# EAGLE design R210I (EAGLE 6.6.0)
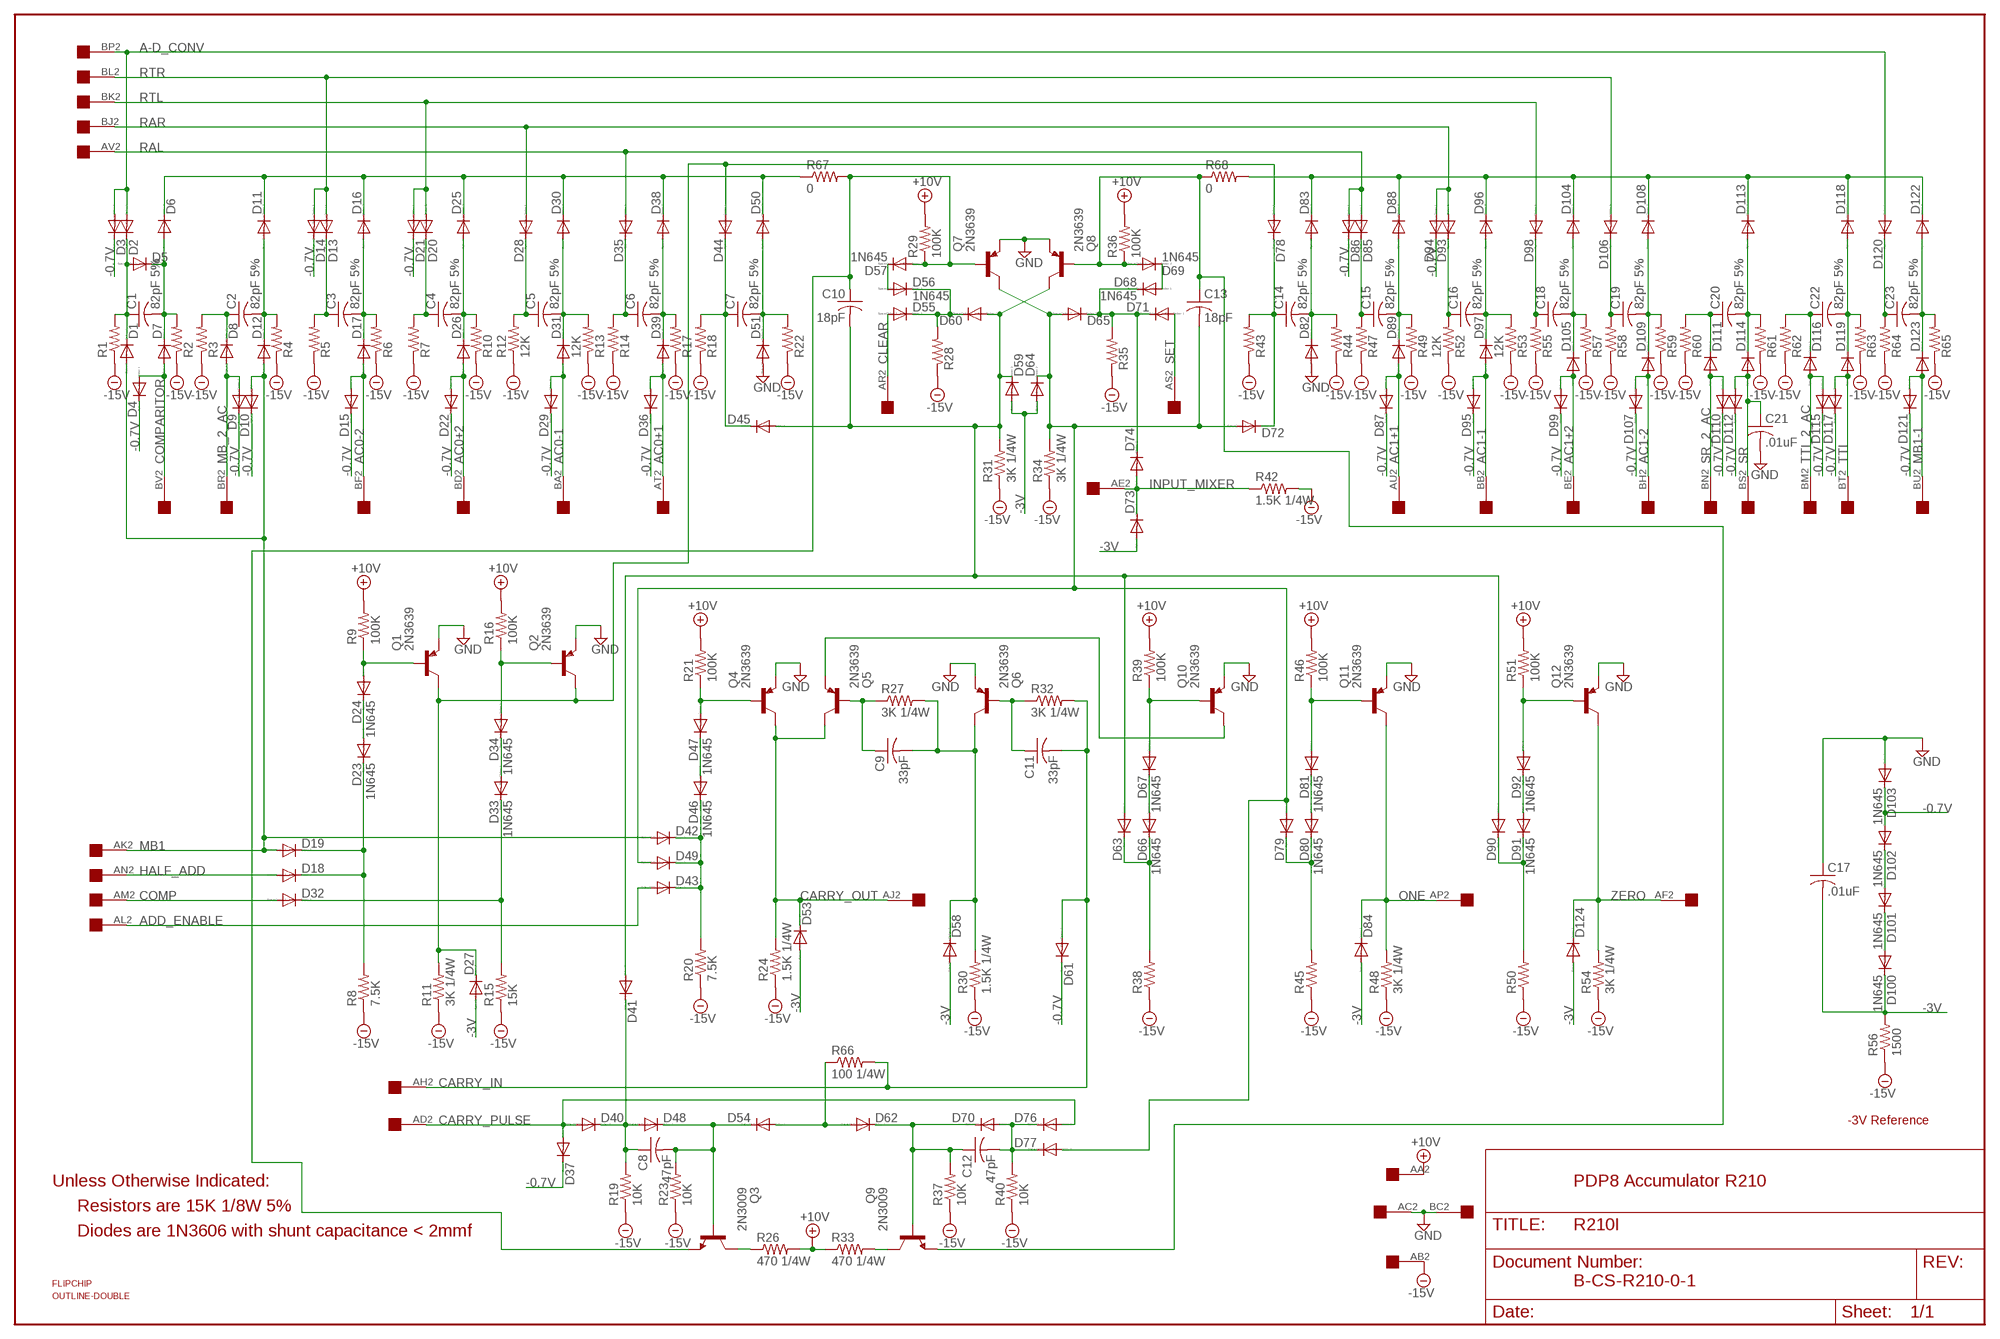
[diagram p0: schematic, sheet 1]

## Parts
C1  82pF 5%  C-US075-032X103  [C075-032X103]
C2  82pF 5%  C-US075-032X103  [C075-032X103]
C3  82pF 5%  C-US075-032X103  [C075-032X103]
C4  82pF 5%  C-US075-032X103  [C075-032X103]
C5  82pF 5%  C-US075-032X103  [C075-032X103]
C6  82pF 5%  C-US075-032X103  [C075-032X103]
C7  82pF 5%  C-US075-032X103  [C075-032X103]
C8  47pF  C-US075-032X103  [C075-032X103]
C9  33pF  C-US075-032X103  [C075-032X103]
C10  18pF  C-US075-032X103  [C075-032X103]
C11  33pF  C-US075-032X103  [C075-032X103]
C12  47pF  C-US075-032X103  [C075-032X103]
C13  18pF  C-US075-032X103  [C075-032X103]
C14  82pF 5%  C-US075-032X103  [C075-032X103]
C15  82pF 5%  C-US075-032X103  [C075-032X103]
C16  82pF 5%  C-US075-032X103  [C075-032X103]
C17  .01uF  C-US050-025X075  [C050-025X075]
C18  82pF 5%  C-US075-032X103  [C075-032X103]
C19  82pF 5%  C-US075-032X103  [C075-032X103]
C20  82pF 5%  C-US075-032X103  [C075-032X103]
C21  .01uF  C-US050-025X075  [C050-025X075]
C22  82pF 5%  C-US075-032X103  [C075-032X103]
C23  82pF 5%  C-US075-032X103  [C075-032X103]
D1  1N4148DO35-10  [DO35-10]
D2  1N4148DO35-10  [DO35-10]
D3  1N4148DO35-10  [DO35-10]
D4  1N4148DO35-10  [DO35-10]
D5  1N4148DO35-10  [DO35-10]
D6  1N4148DO35-10  [DO35-10]
D7  1N4148DO35-10  [DO35-10]
D8  1N4148DO35-10  [DO35-10]
D9  1N4148DO35-10  [DO35-10]
D10  1N4148DO35-10  [DO35-10]
D11  1N4148DO35-10  [DO35-10]
D12  1N4148DO35-10  [DO35-10]
D13  1N4148DO35-10  [DO35-10]
D14  1N4148DO35-10  [DO35-10]
D15  1N4148DO35-10  [DO35-10]
D16  1N4148DO35-10  [DO35-10]
D17  1N4148DO35-10  [DO35-10]
D18  1N4148DO35-10  [DO35-10]
D19  1N4148DO35-10  [DO35-10]
D20  1N4148DO35-10  [DO35-10]
D21  1N4148DO35-10  [DO35-10]
D22  1N4148DO35-10  [DO35-10]
D23  1N645  1N4148DO35-10  [DO35-10]
D24  1N645  1N4148DO35-10  [DO35-10]
D25  1N4148DO35-10  [DO35-10]
D26  1N4148DO35-10  [DO35-10]
D27  1N4148DO35-10  [DO35-10]
D28  1N4148DO35-10  [DO35-10]
D29  1N4148DO35-10  [DO35-10]
D30  1N4148DO35-10  [DO35-10]
D31  1N4148DO35-10  [DO35-10]
D32  1N4148DO35-10  [DO35-10]
D33  1N645  1N4148DO35-10  [DO35-10]
D34  1N645  1N4148DO35-10  [DO35-10]
D35  1N4148DO35-10  [DO35-10]
D36  1N4148DO35-10  [DO35-10]
D37  1N4148DO35-10  [DO35-10]
D38  1N4148DO35-10  [DO35-10]
D39  1N4148DO35-10  [DO35-10]
D40  1N4148DO35-10  [DO35-10]
D41  1N4148DO35-10  [DO35-10]
D42  1N4148DO35-10  [DO35-10]
D43  1N4148DO35-10  [DO35-10]
D44  1N4148DO35-10  [DO35-10]
D45  1N4148DO35-10  [DO35-10]
D46  1N645  1N4148DO35-10  [DO35-10]
D47  1N645  1N4148DO35-10  [DO35-10]
D48  1N4148DO35-10  [DO35-10]
D49  1N4148DO35-10  [DO35-10]
D50  1N4148DO35-10  [DO35-10]
D51  1N4148DO35-10  [DO35-10]
D53  1N4148DO35-10  [DO35-10]
D54  1N4148DO35-10  [DO35-10]
D55  1N4148DO35-10  [DO35-10]
D56  1N645  1N4148DO35-10  [DO35-10]
D57  1N645  1N4148DO35-10  [DO35-10]
D58  1N4148DO35-10  [DO35-10]
D59  1N4148DO35-10  [DO35-10]
D60  1N4148DO35-10  [DO35-10]
D61  1N4148DO35-10  [DO35-10]
D62  1N4148DO35-10  [DO35-10]
D63  1N4148DO35-10  [DO35-10]
D64  1N4148DO35-10  [DO35-10]
D65  1N4148DO35-10  [DO35-10]
D66  1N645  1N4148DO35-10  [DO35-10]
D67  1N645  1N4148DO35-10  [DO35-10]
D68  1N645  1N4148DO35-10  [DO35-10]
D69  1N645  1N4148DO35-10  [DO35-10]
D70  1N4148DO35-10  [DO35-10]
D71  1N4148DO35-10  [DO35-10]
D72  1N4148DO35-10  [DO35-10]
D73  1N4148DO35-10  [DO35-10]
D74  1N4148DO35-10  [DO35-10]
D76  1N4148DO35-10  [DO35-10]
D77  1N4148DO35-10  [DO35-10]
D78  1N4148DO35-10  [DO35-10]
D79  1N4148DO35-10  [DO35-10]
D80  1N645  1N4148DO35-10  [DO35-10]
D81  1N645  1N4148DO35-10  [DO35-10]
D82  1N4148DO35-10  [DO35-10]
D83  1N4148DO35-10  [DO35-10]
D84  1N4148DO35-10  [DO35-10]
D85  1N4148DO35-10  [DO35-10]
D86  1N4148DO35-10  [DO35-10]
D87  1N4148DO35-10  [DO35-10]
D88  1N4148DO35-10  [DO35-10]
D89  1N4148DO35-10  [DO35-10]
D90  1N4148DO35-10  [DO35-10]
D91  1N645  1N4148DO35-10  [DO35-10]
D92  1N645  1N4148DO35-10  [DO35-10]
D93  1N4148DO35-10  [DO35-10]
D94  1N4148DO35-10  [DO35-10]
D95  1N4148DO35-10  [DO35-10]
D96  1N4148DO35-10  [DO35-10]
D97  1N4148DO35-10  [DO35-10]
D98  1N4148DO35-10  [DO35-10]
D99  1N4148DO35-10  [DO35-10]
D100  1N645  1N4148DO35-10  [DO35-10]
D101  1N645  1N4148DO35-10  [DO35-10]
D102  1N645  1N4148DO35-10  [DO35-10]
D103  1N645  1N4148DO35-10  [DO35-10]
D104  1N4148DO35-10  [DO35-10]
D105  1N4148DO35-10  [DO35-10]
D106  1N4148DO35-10  [DO35-10]
D107  1N4148DO35-10  [DO35-10]
D108  1N4148DO35-10  [DO35-10]
D109  1N4148DO35-10  [DO35-10]
D110  1N4148DO35-10  [DO35-10]
D111  1N4148DO35-10  [DO35-10]
D112  1N4148DO35-10  [DO35-10]
D113  1N4148DO35-10  [DO35-10]
D114  1N4148DO35-10  [DO35-10]
D115  1N4148DO35-10  [DO35-10]
D116  1N4148DO35-10  [DO35-10]
D117  1N4148DO35-10  [DO35-10]
D118  1N4148DO35-10  [DO35-10]
D119  1N4148DO35-10  [DO35-10]
D120  1N4148DO35-10  [DO35-10]
D121  1N4148DO35-10  [DO35-10]
D122  1N4148DO35-10  [DO35-10]
D123  1N4148DO35-10  [DO35-10]
D124  1N4148DO35-10  [DO35-10]
Q1  2N3639  2N3637  [TO39]
Q2  2N3639  2N3637  [TO39]
Q3  2N3009  2N2102  [TO5]
Q4  2N3639  2N3637  [TO39]
Q5  2N3639  2N3637  [TO39]
Q6  2N3639  2N3637  [TO39]
Q7  2N3639  2N3637  [TO39]
Q8  2N3639  2N3637  [TO39]
Q9  2N3009  2N2102  [TO5]
Q10  2N3639  2N3637  [TO39]
Q11  2N3639  2N3637  [TO39]
Q12  2N3639  2N3637  [TO39]
R1  R-US_0207/10  [0207/10]
R2  R-US_0207/10  [0207/10]
R3  R-US_0207/10  [0207/10]
R4  R-US_0207/10  [0207/10]
R5  R-US_0207/10  [0207/10]
R6  R-US_0207/10  [0207/10]
R7  R-US_0207/10  [0207/10]
R8  7.5K  R-US_0207/10  [0207/10]
R9  100K  R-US_0207/10  [0207/10]
R10  R-US_0207/10  [0207/10]
R11  3K 1/4W  R-US_0207/10  [0207/10]
R12  12K  R-US_0207/10  [0207/10]
R13  12K  R-US_0207/10  [0207/10]
R14  R-US_0207/10  [0207/10]
R15  15K  R-US_0207/10  [0207/10]
R16  100K  R-US_0207/10  [0207/10]
R17  R-US_0207/10  [0207/10]
R18  R-US_0207/10  [0207/10]
R19  10K  R-US_0207/10  [0207/10]
R20  7.5K  R-US_0207/10  [0207/10]
R21  100K  R-US_0207/10  [0207/10]
R22  R-US_0207/10  [0207/10]
R23  10K  R-US_0207/10  [0207/10]
R24  1.5K 1/4W  R-US_0207/10  [0207/10]
R26  470 1/4W  R-US_0207/10  [0207/10]
R27  3K 1/4W  R-US_0207/10  [0207/10]
R28  R-US_0207/10  [0207/10]
R29  100K  R-US_0207/10  [0207/10]
R30  1.5K 1/4W  R-US_0207/10  [0207/10]
R31  3K 1/4W  R-US_0207/10  [0207/10]
R32  3K 1/4W  R-US_0207/10  [0207/10]
R33  470 1/4W  R-US_0207/10  [0207/10]
R34  3K 1/4W  R-US_0207/10  [0207/10]
R35  R-US_0207/10  [0207/10]
R36  100K  R-US_0207/10  [0207/10]
R37  10K  R-US_0207/10  [0207/10]
R38  R-US_0207/10  [0207/10]
R39  100K  R-US_0207/10  [0207/10]
R40  10K  R-US_0207/10  [0207/10]
R42  1.5K 1/4W  R-US_0207/10  [0207/10]
R43  R-US_0207/10  [0207/10]
R44  R-US_0207/10  [0207/10]
R45  R-US_0207/10  [0207/10]
R46  100K  R-US_0207/10  [0207/10]
R47  R-US_0207/10  [0207/10]
R48  3K 1/4W  R-US_0207/10  [0207/10]
R49  R-US_0207/10  [0207/10]
R50  R-US_0207/10  [0207/10]
R51  100K  R-US_0207/10  [0207/10]
R52  12K  R-US_0207/10  [0207/10]
R53  12K  R-US_0207/10  [0207/10]
R54  3K 1/4W  R-US_0207/10  [0207/10]
R55  R-US_0207/10  [0207/10]
R56  1500  R-US_0207/10  [0207/10]
R57  R-US_0207/10  [0207/10]
R58  R-US_0207/10  [0207/10]
R59  R-US_0207/10  [0207/10]
R60  R-US_0207/10  [0207/10]
R61  R-US_0207/10  [0207/10]
R62  R-US_0207/10  [0207/10]
R63  R-US_0207/10  [0207/10]
R64  R-US_0207/10  [0207/10]
R65  R-US_0207/10  [0207/10]
R66  100 1/4W  R-US_0207/10  [0207/10]
R67  0  R-US_0207/10  [0207/10]
R68  0  R-US_0207/10  [0207/10]
U$1  DOUBLE  [EDGE-CON4]
U$2  FLIPCHIP  [FLIPCHIP]
U$3  OUTLINE-DOUBLE  [DOUBLE]

## Nets
+10V [Power]: R9.2 R16.2 R21.2 R26.2 R29.2 R33.1 R36.2 R39.2 R46.2 R51.2 U$1.AA2
-0.7V [Power]: D3.C D4.C D9.C D10.C D14.C D15.C D21.C D22.C D29.C D36.C D37.C D61.C D86.C D87.C D94.C D95.C D99.C D102.A D103.C D107.C D110.C D112.C D115.C D117.C D121.C
-3V [Power]: C17.2 D27.A D53.A D58.A D59.A D64.A D73.A D84.A D100.C D124.A R56.2
-15V [Power]: R1.1 R2.1 R3.1 R4.1 R5.1 R6.1 R7.1 R8.1 R10.1 R11.1 R12.1 R13.1 R14.1 R15.1 R17.1 R18.1 R19.1 R20.1 R22.1 R23.1 R24.1 R28.1 R30.1 R31.1 R34.1 R35.1 R37.1 R38.1 R40.1 R42.2 R43.1 R44.1 R45.1 R47.1 R48.1 R49.1 R50.1 R52.1 R53.1 R54.1 R55.1 R56.1 R57.1 R58.1 R59.1 R60.1 R61.1 R62.1 R63.1 R64.1 R65.1 U$1.AB2
A-D_CONV: D2.A D3.A D120.A U$1.BP2
AC0+1: D36.A D39.A U$1.AT2
AC0+2: D22.A D26.A U$1.BD2
AC0-1: D29.A D31.A U$1.BA2
AC0-2: D15.A D17.A U$1.BF2
AC1+1: D87.A D89.A U$1.AU2
AC1+2: D99.A D105.A U$1.BE2
AC1-1: D95.A D97.A U$1.BB2
AC1-2: D107.A D109.A U$1.BH2
ADD_ENABLE: D43.A U$1.AL2
CARRY_IN: C11.2 D61.A R32.2 R66.2 U$1.AH2
CARRY_OUT: D53.C Q4.3(C) Q5.3(C) R24.2 U$1.AJ2
CARRY_PULSE: D37.A D40.A D76.A U$1.AD2
CLEAR: D55.A U$1.AR2
COMP: D32.A U$1.AM2
COMPARITOR: D4.A D7.A U$1.BV2
GND [Power]: C17.1 C21.2 D51.A D82.A D103.A Q1.1(E) Q2.1(E) Q4.1(E) Q6.1(E) Q7.1(E) Q8.1(E) Q10.1(E) Q11.1(E) Q12.1(E) U$1.AC2 U$1.BC2
HALF_ADD: D18.A U$1.AN2
INPUT_MIXER: D73.C D74.A R42.1 U$1.AE2
MB1: D1.A D10.A D12.A D19.A D42.A U$1.AK2
MB1-1: D121.A D123.A U$1.BU2
MB_2_AC: D8.A D9.A U$1.BR2
N$1: D6.C D11.C D16.C D25.C D30.C D38.C D50.C R67.1
N$2: D27.C D44.A D78.A Q1.3(C) Q2.3(C) R11.2
N$3: C1.2 D5.C D6.A D7.C R2.2
N$4: C1.1 D1.C D2.C D5.A R1.2
N$5: D18.C D19.C D23.C R8.2
N$6: C2.1 D8.C R3.2
N$7: C2.2 D11.A D12.C R4.2
N$8: C10.2 D41.A D45.A D59.C D60.A D63.A D90.A Q8.3(C) R31.2
N$9: C13.2 D49.A D64.C D65.A D72.A D77.A D79.A Q7.3(C) R34.2
N$10: D55.C D56.C D60.C R28.2
N$11: D56.A D57.C
N$12: C3.1 D13.C R5.2
N$13: D101.A D102.C
N$14: C3.2 D16.A D17.C R6.2
N$15: C10.1 D57.A Q3.1(E) Q7.2(B) R29.1 R67.2
N$16: D100.A D101.C
N$17: D66.A D67.C
N$18: C4.1 D20.C R7.2
N$19: C4.2 D25.A D26.C R10.2
N$20: C13.1 D69.A Q8.2(B) Q9.1(E) R36.1 R68.1
N$21: D68.A D69.C
N$22: C5.1 D28.C R12.2
N$23: C5.2 D30.A D31.C R13.2
N$24: D65.C D68.C D71.C D74.C R35.2
N$25: D83.C D88.C D96.C D104.C D108.C D113.C D118.C D122.C R68.2
N$26: C6.1 D35.C R14.2
N$27: C6.2 D38.A D39.C R17.2
N$28: C12.1 D62.C D70.C Q9.2(B) R37.2
N$29: C14.1 D72.C D78.C R43.2
N$30: C7.1 D44.C D45.C R18.2
N$31: C7.2 D50.A D51.C R22.2
N$32: C14.2 D82.C D83.A R44.2
N$33: C15.1 D85.C R47.2
N$34: C15.2 D88.A D89.C R49.2
N$35: C16.1 D93.C R52.2
N$36: C16.2 D96.A D97.C R53.2
N$37: C18.1 D98.C R55.2
N$38: C18.2 D104.A D105.C R57.2
N$39: D24.A Q1.2(B) R9.1
N$40: D23.A D24.C
N$41: C19.1 D106.C R58.2
N$42: C19.2 D108.A D109.C R59.2
N$44: D33.A D34.C
N$45: C20.1 D111.C R60.2
N$46: C20.2 D113.A D114.C R61.2
N$47: C12.2 D70.A D76.C D77.C R40.2
N$48: D32.C D33.C R15.2
N$49: C22.1 D116.C R62.2
N$50: C22.2 D118.A D119.C R63.2
N$51: D34.A Q2.2(B) R16.1
N$52: D47.A Q4.2(B) R21.1
N$53: C23.1 D120.C R64.2
N$54: C23.2 D122.A D123.C R65.2
N$55: D46.A D47.C
N$56: D42.C D43.C D46.C D49.C R20.2
N$57: C9.1 Q5.2(B) R27.1
N$58: C9.2 D58.C Q6.3(C) R27.2 R30.2
N$59: Q5.1(E) Q10.3(C)
N$60: C11.1 Q6.2(B) R32.1
N$61: D54.A D62.A R66.1
N$62: D67.A Q10.2(B) R39.1
N$63: D63.C D66.C R38.2
N$64: D81.A Q11.2(B) R46.1
N$65: C8.1 D40.C D41.C D48.A R19.2
N$66: D80.A D81.C
N$67: D79.C D80.C R45.2
N$68: D92.A Q12.2(B) R51.1
N$69: D90.C D91.C R50.2
N$70: D91.A D92.C
N$71: C8.2 D48.C D54.C Q3.2(B) R23.2
N$73: Q3.3(C) R26.1
N$74: Q9.3(C) R33.2
ONE: D84.C Q11.3(C) R48.2 U$1.AP2
RAL: D35.A D85.A D86.A U$1.AV2
RAR: D28.A D93.A D94.A U$1.BJ2
RTL: D20.A D21.A D98.A U$1.BK2
RTR: D13.A D14.A D106.A U$1.BL2
SET: D71.A U$1.AS2
SR: C21.1 D112.A D114.A U$1.BS2
SR_2_AC: D110.A D111.A U$1.BN2
TTI: D117.A D119.A U$1.BT2
TTI_2_AC: D115.A D116.A U$1.BM2
ZERO: D124.C Q12.3(C) R54.2 U$1.AF2
Unconnected: U$1.AA1 U$1.AB1 U$1.AC1 U$1.AD1 U$1.AE1 U$1.AF1 U$1.AH1 U$1.AJ1 U$1.AK1 U$1.AL1 U$1.AM1 U$1.AN1 U$1.AP1 U$1.AR1 U$1.AS1 U$1.AT1 U$1.AU1 U$1.AV1 U$1.BA1 U$1.BB1 U$1.BC1 U$1.BD1 U$1.BE1 U$1.BF1 U$1.BH1 U$1.BJ1 U$1.BK1 U$1.BL1 U$1.BM1 U$1.BN1 U$1.BP1 U$1.BR1 U$1.BS1 U$1.BT1 U$1.BU1 U$1.BV1

## Notes on the sheet
- -3V Reference
- Unless Otherwise Indicated: | PDP8 Accumulator R210
- Resistors are 15K 1/8W 5%
- Diodes are 1N3606 with shunt capacitance < 2mmf
- B-CS-R210-0-1

## Library data of the parts
C1-C23 = rcl:C-US: CAPACITOR, American symbol
D1-D51 D53-D74 D76-D124 = diode:1N4148: DIODE high speed (Philips)
Q1 Q2 Q4-Q8 Q10-Q12 = transistor-pnp:2N3637*: PNP Transistror
Q3 Q9 = transistor-npn:2N2102: NPN Transistor
R1-R24 R26-R40 R42-R68 = rcl:R-US_: RESISTOR, American symbol
U$1 = dec-con:DOUBLE: Double-Height DEC board
U$2 = dec-con:FLIPCHIP: FLIP CHIP Logo, component side
U$3 = dec-con:OUTLINE-*: Board outlines for DEC boards.

## Net classes
1 Power: width 0.813 mm

## Board
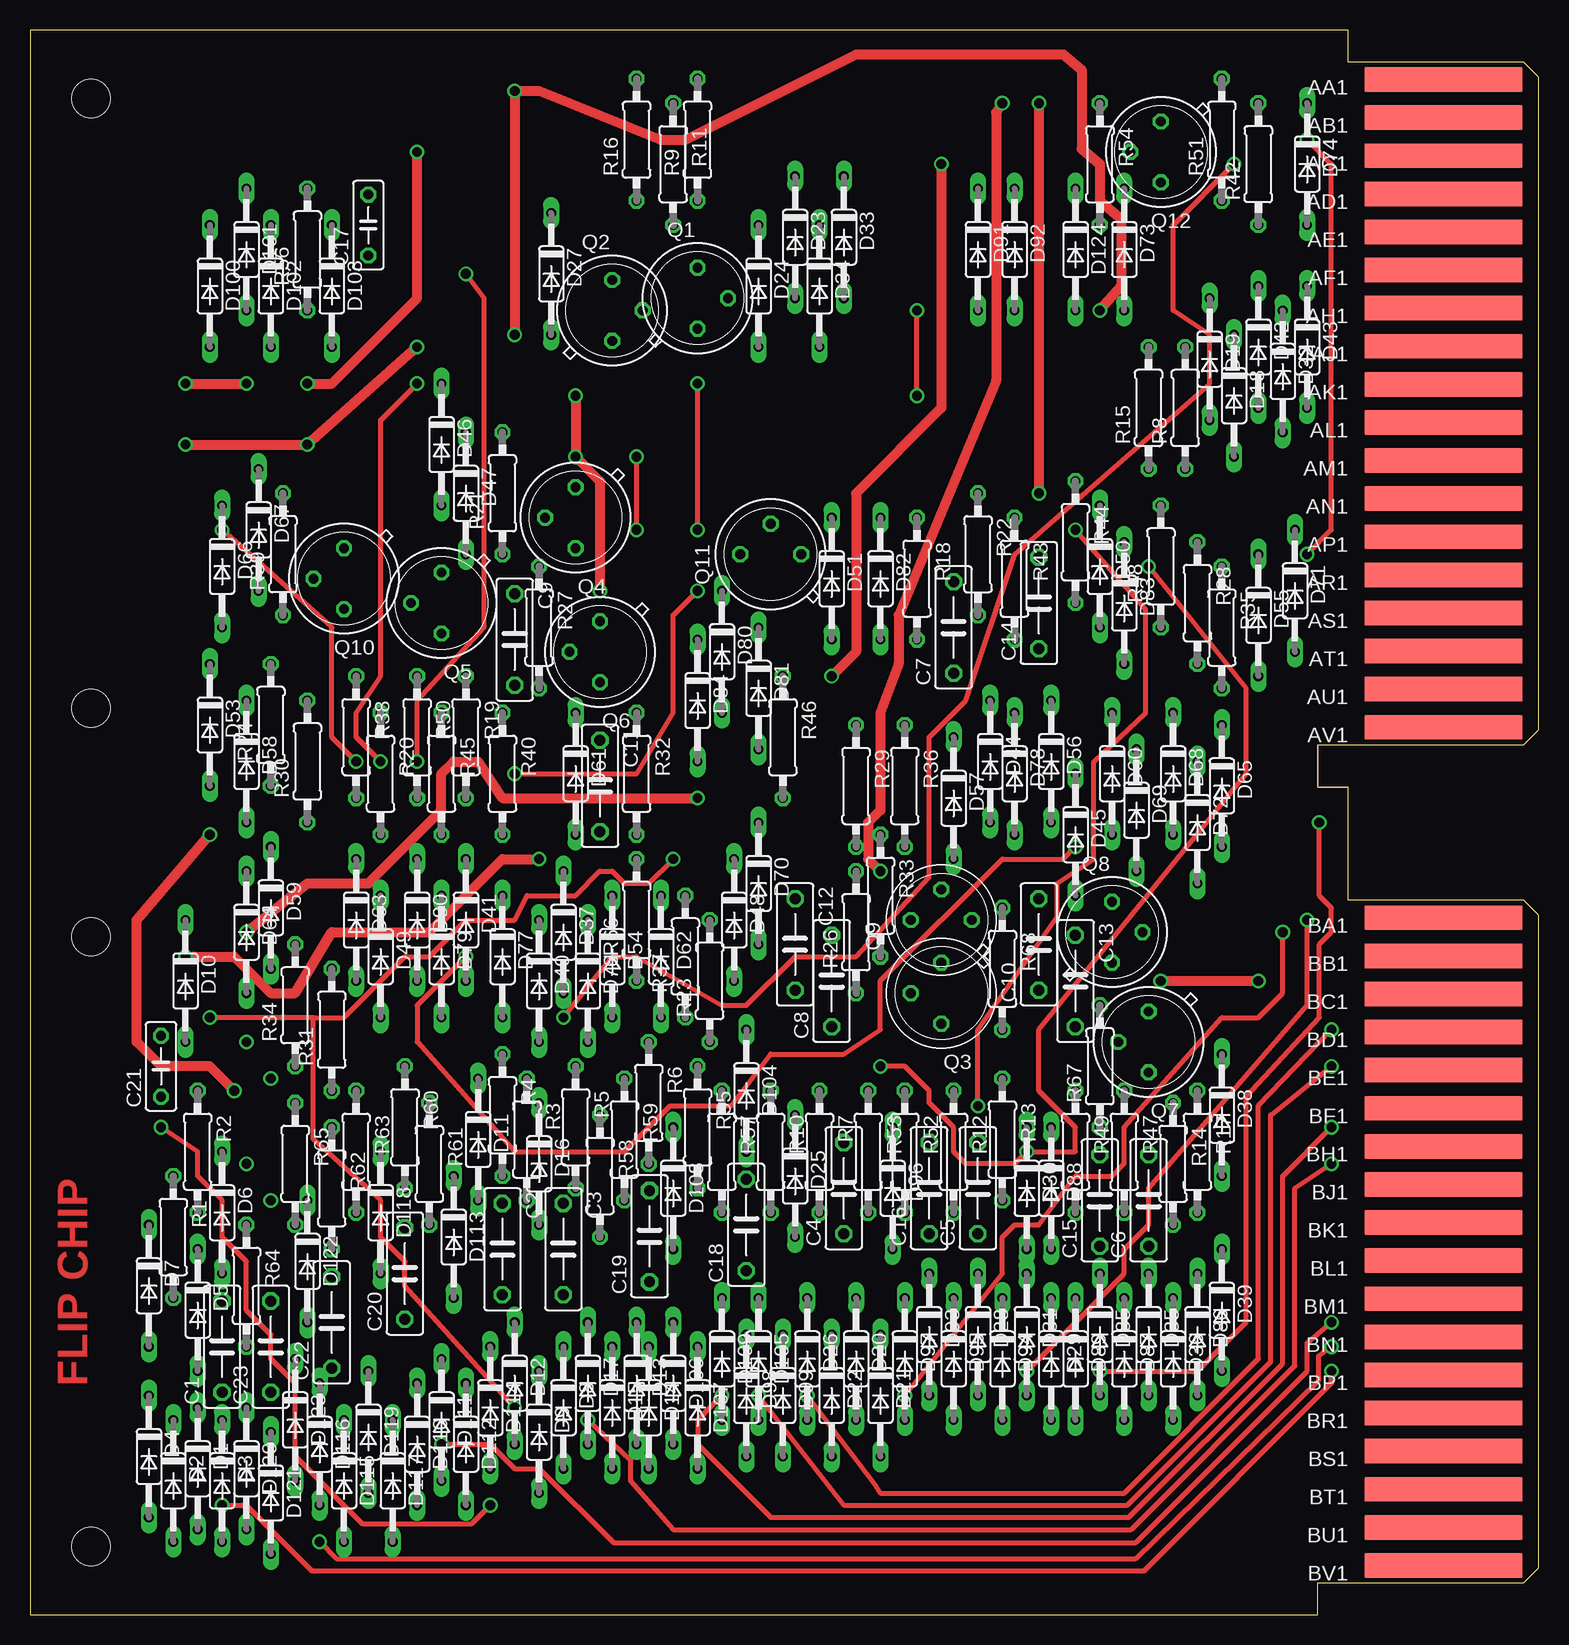
[diagram p1: board, top side]
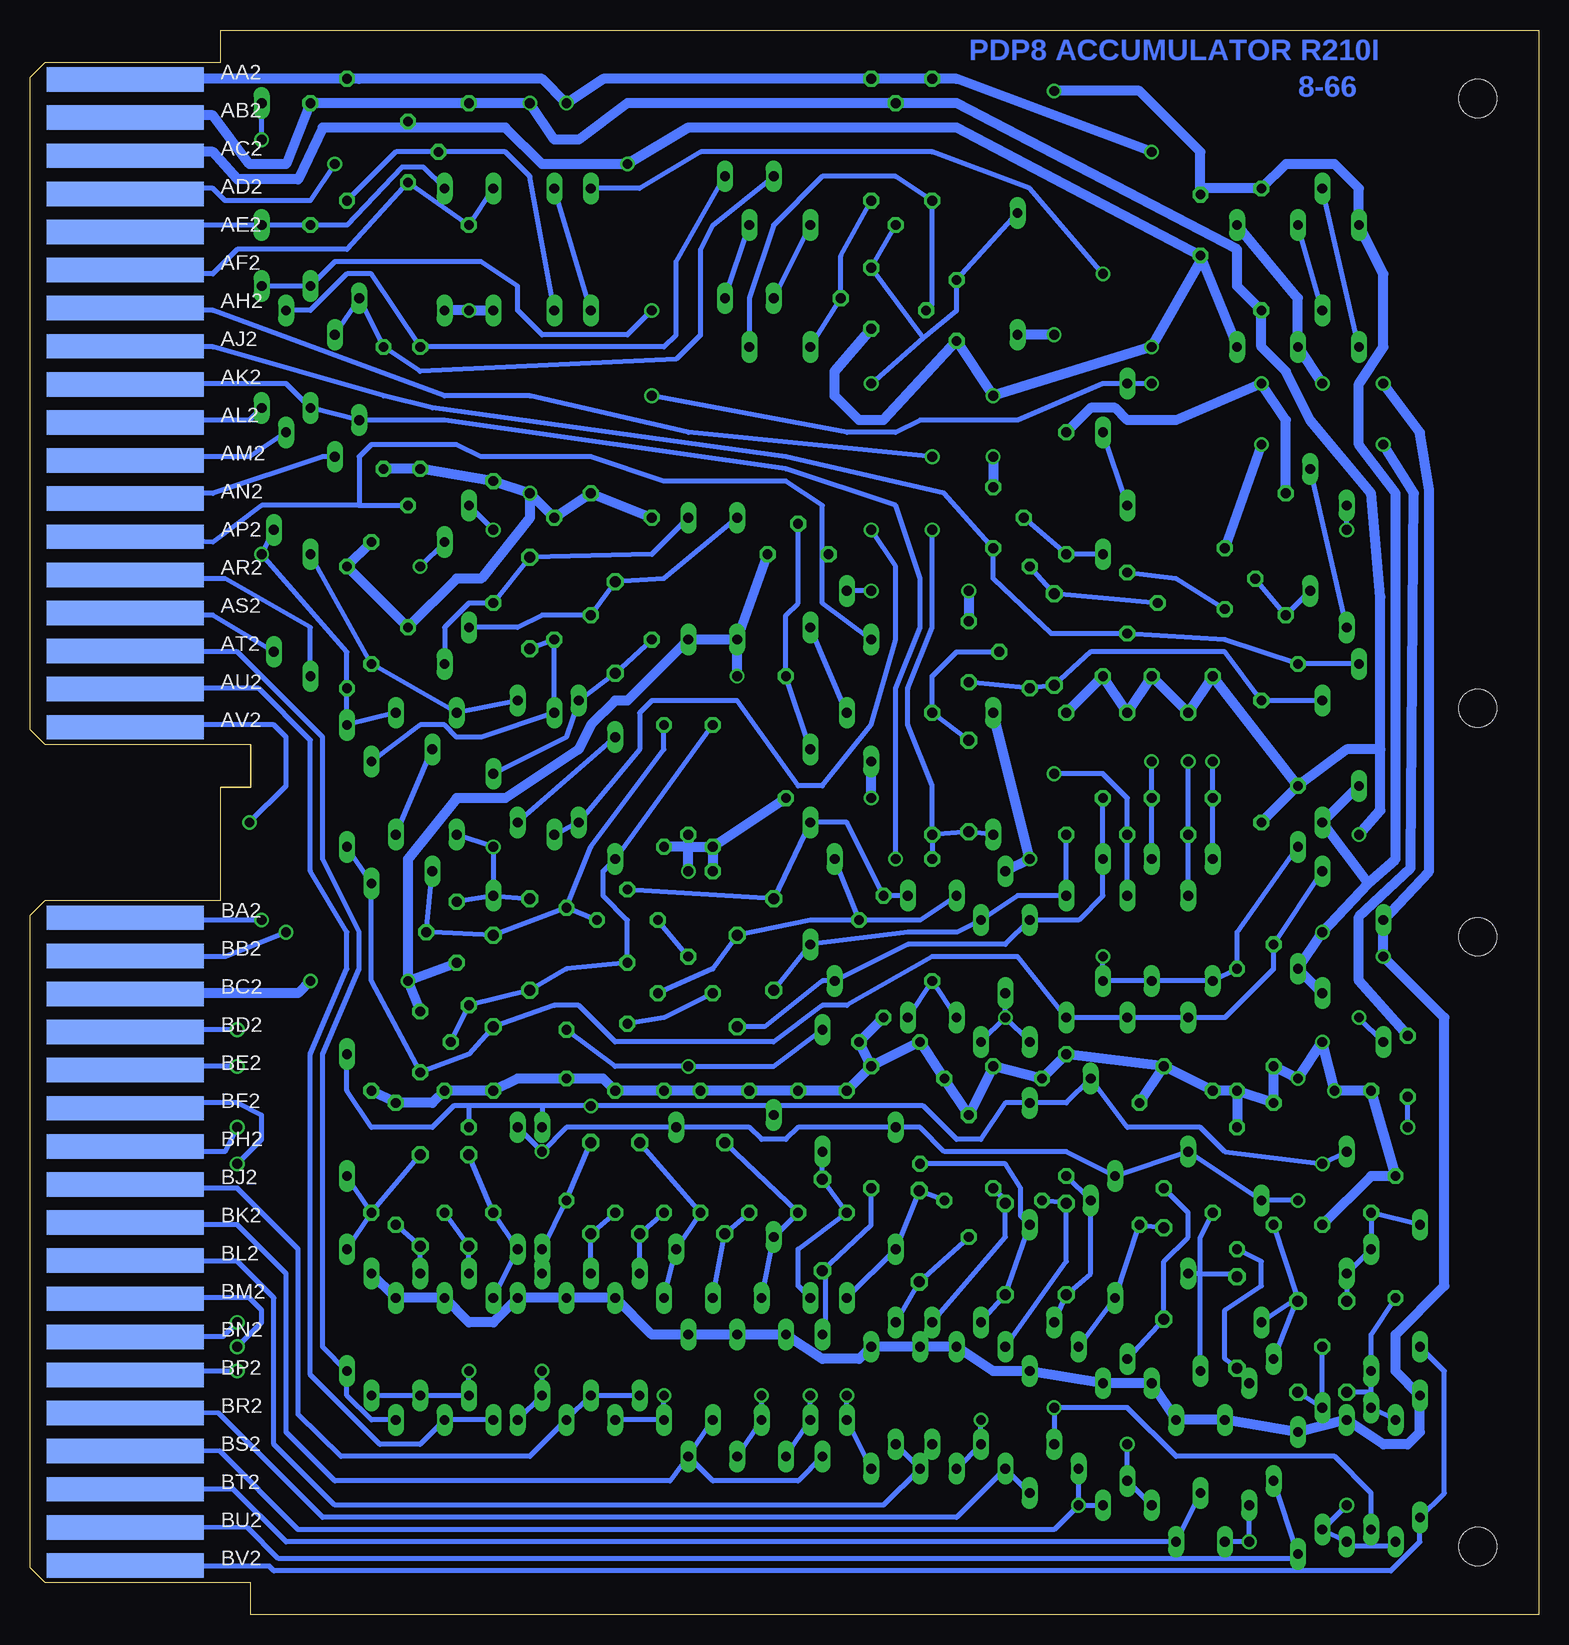
[diagram p2: board, bottom side, seen from below]

Size 125.73 x 132.08 mm. Coordinates in mm from the lower left corner, seen from the top.
Copper layers (1+16): Top 0.035mm / dielectric 1.5mm / Bottom 0.035mm
Design rules "16mils": minimum track width 16mil, minimum drill 32mil, track to track 15mil, track to pad 10mil, pad to pad 10mil, via to via 10mil, smd to smd 10mil, copper to edge 13mil, drill to drill 10mil, minimum pad ring 10mil, minimum via ring 8mil, stop-mask expansion 0mil, vias tented up to drill 0mil, thermal gap 10mil

### Footprints (pad centres in the part's own frame; a part is rotated, then mirrored left to right if it is on the bottom)
C075-032X103 = drill 0.914 octagon: 1 -3.81,0; 2 3.81,0
C050-025X075 = drill 0.813 octagon: 1 -2.54,0; 2 2.54,0
DO35-10 = drill 0.813 long: A 5.08,0; C -5.08,0
TO39 = drill 0.813 octagon: 1 0,-2.54; 2 2.54,0; 3 0,2.54
TO5 = drill 0.813 octagon: 1 0,-2.54; 2 2.54,0; 3 0,2.54
0207/10 = drill 0.813 octagon: 1 -5.08,0; 2 5.08,0
EDGE-CON4 = smd 13.106 x 2.032: AA1 7.938,4.128; AB1 7.938,7.303; AC1 7.938,10.477; AD1 7.938,13.652; AE1 7.938,16.828; AF1 7.938,20.003; AH1 7.938,23.177; AJ1 7.938,26.352; AK1 7.938,29.527; AL1 7.938,32.703; AM1 7.938,35.877; AN1 7.938,39.053; AP1 7.938,42.227; AR1 7.938,45.403; AS1 7.938,48.578; AT1 7.938,51.752; AU1 7.938,54.928; AV1 7.938,58.102; BA1 7.938,73.978; BB1 7.938,77.153; BC1 7.938,80.328; BD1 7.938,83.502; BE1 7.938,86.677; BF1 7.938,89.853; BH1 7.938,93.028; BJ1 7.938,96.203; BK1 7.938,99.377; BL1 7.938,102.552; BM1 7.938,105.728; BN1 7.938,108.903; BP1 7.938,112.078; BR1 7.938,115.252; BS1 7.938,118.427; BT1 7.938,121.603; BU1 7.938,124.778; BV1 7.938,127.953 | smd 13.106 x 2.032 bottom: AA2 7.938,4.128; AB2 7.938,7.303; AC2 7.938,10.477; AD2 7.938,13.652; AE2 7.938,16.828; AF2 7.938,20.003; AH2 7.938,23.177; AJ2 7.938,26.352; AK2 7.938,29.527; AL2 7.938,32.703; AM2 7.938,35.877; AN2 7.938,39.053; AP2 7.938,42.227; AR2 7.938,45.403; AS2 7.938,48.578; AT2 7.938,51.752; AU2 7.938,54.928; AV2 7.938,58.102; BA2 7.938,73.978; BB2 7.938,77.153; BC2 7.938,80.328; BD2 7.938,83.502; BE2 7.938,86.677; BF2 7.938,89.853; BH2 7.938,93.028; BJ2 7.938,96.203; BK2 7.938,99.377; BL2 7.938,102.552; BM2 7.938,105.728; BN2 7.938,108.903; BP2 7.938,112.078; BR2 7.938,115.252; BS2 7.938,118.427; BT2 7.938,121.603; BU2 7.938,124.778; BV2 7.938,127.953
DOUBLE = hole 3.175: 120.65,56.515; 120.65,5.715; 120.65,75.565; 120.65,126.365

### Placement (x,y rotation side)
C1  16,22.35 90 top
C2  39.37,30.48 270 top
C3  44.45,30.48 270 top
C4  67.82,35.56 90 top
C5  78.99,35.56 90 top
C6  93.22,34.54 90 top
C7  76.96,82.3 90 top
C8  66.8,52.83 90 top
C9  40.39,81.28 270 top
C10  84.07,55.88 90 top
C11  47.5,69.09 270 top
C12  63.75,55.88 270 top
C13  87.12,52.83 270 top
C14  84.07,84.33 90 top
C15  89.15,34.54 90 top
C16  74.93,35.56 90 top
C17  28.19,115.82 90 top
C18  59.69,32.51 90 top
C19  51.63,31.56 90 top
C20  31.24,28.45 90 top
C21  10.92,45.72 90 top
C22  25.15,24.38 90 top
C23  20.07,22.35 90 top
D1  13.97,12.19 270 top
D2  11.94,11.18 270 top
D3  16,11.18 270 top
D4  9.91,13.21 270 top
D5  13.97,25.4 270 top
D6  16,33.53 270 top
D7  9.91,27.43 270 top
D8  44.45,17.27 270 top
D9  42.42,15.24 270 top
D10  12.95,52.83 270 top
D11  37.34,39.62 270 top
D12  40.39,19.3 270 top
D13  50.55,19.3 270 top
D14  51.56,17.27 270 top
D15  48.51,17.27 270 top
D16  42.42,37.59 270 top
D17  46.48,19.3 270 top
D18  100.33,101.6 270 top
D19  98.3,104.65 270 top
D20  68.83,21.34 270 top
D21  70.87,18.29 270 top
D22  66.8,18.29 270 top
D23  63.75,114.81 270 top
D24  60.71,110.74 270 top
D25  63.75,36.58 270 top
D26  64.77,21.34 270 top
D27  43.43,111.76 270 top
D28  78.99,23.37 270 top
D29  85.09,21.34 270 top
D30  83.06,35.56 270 top
D31  83.06,23.37 270 top
D32  104.39,103.63 270 top
D33  67.82,114.81 270 top
D34  65.79,110.74 270 top
D35  93.22,23.37 270 top
D36  95.25,21.34 270 top
D37  44.45,56.9 270 top
D38  99.31,41.66 270 top
D39  99.31,25.4 270 top
D40  42.42,52.83 270 top
D41  36.32,57.91 270 top
D42  102.36,105.66 270 top
D43  106.43,105.66 270 top
D44  80.01,71.12 270 top
D45  87.12,65.02 270 top
D46  34.29,97.54 270 top
D47  36.32,93.47 270 top
D48  58.67,57.91 270 top
D49  29.21,54.86 270 top
D50  89.15,87.38 270 top
D51  66.8,86.36 270 top
D53  14.99,74.17 270 top
D54  48.51,54.86 270 top
D55  102.36,83.31 270 top
D56  85.09,71.12 270 top
D57  76.96,68.07 270 top
D58  18.03,71.12 270 top
D59  20.07,58.93 270 top
D60  90.17,70.1 270 top
D61  45.47,70.1 270 top
D62  52.58,54.86 270 top
D63  27.18,57.91 270 top
D64  18.03,56.9 270 top
D65  99.31,69.09 270 top
D66  16,87.38 270 top
D67  19.05,90.42 270 top
D68  95.25,70.1 270 top
D69  92.2,67.06 270 top
D70  60.71,60.96 270 top
D71  105.41,85.34 270 top
D72  97.28,66.04 270 top
D73  91.19,113.79 270 top
D74  106.43,120.9 270 top
D76  46.48,52.83 270 top
D77  39.37,54.86 270 top
D78  82.04,70.1 270 top
D79  34.29,54.86 270 top
D80  57.66,80.26 270 top
D81  60.71,77.22 270 top
D82  70.87,86.36 270 top
D83  91.19,84.33 270 top
D84  55.63,76.2 270 top
D85  89.15,23.37 270 top
D86  97.28,23.37 270 top
D87  91.19,21.34 270 top
D88  85.09,35.56 270 top
D89  87.12,21.34 270 top
D90  32.26,57.91 270 top
D91  78.99,113.79 270 top
D92  82.04,113.79 270 top
D93  74.93,23.37 270 top
D94  81.03,21.34 270 top
D95  76.96,21.34 270 top
D96  71.88,35.56 270 top
D97  72.9,21.34 270 top
D98  59.69,18.29 270 top
D99  62.74,18.29 270 top
D100  14.99,110.74 270 top
D101  18.03,113.79 270 top
D102  20.07,110.74 270 top
D103  25.15,110.74 270 top
D104  59.69,43.69 270 top
D105  60.71,21.34 270 top
D106  53.59,19.3 270 top
D107  55.63,17.27 270 top
D108  53.59,35.56 270 top
D109  57.66,21.34 270 top
D110  32.26,14.22 270 top
D111  34.29,16.26 270 top
D112  36.32,14.22 270 top
D113  35.31,31.5 270 top
D114  38.35,17.27 270 top
D115  26.16,11.18 270 top
D116  24.13,14.22 270 top
D117  30.23,11.18 270 top
D118  29.21,33.53 270 top
D119  28.19,15.24 270 top
D120  18.03,12.19 270 top
D121  20.07,10.16 270 top
D122  23.11,29.46 270 top
D123  22.1,16.26 270 top
D124  87.12,113.79 270 top
Q1  55.63,109.73 0 top
Q2  48.51,108.71 0 top
Q3  75.95,51.82 180 top
Q4  45.47,91.44 180 top
Q5  34.29,84.33 180 top
Q6  47.5,80.26 180 top
Q7  93.22,47.75 180 top
Q8  90.17,56.9 0 top
Q9  75.95,57.91 90 top
Q10  26.16,86.36 180 top
Q11  61.72,88.39 90 top
Q12  94.23,121.92 180 top
R1  11.94,31.5 270 top
R2  13.97,38.61 270 top
R3  41.4,39.62 270 top
R4  39.37,41.66 270 top
R5  45.47,40.64 270 top
R6  51.56,42.67 270 top
R7  65.79,38.61 270 top
R8  96.27,100.58 90 top
R9  55.63,122.94 90 top
R10  61.72,38.61 270 top
R11  53.59,120.9 270 top
R12  76.96,38.61 270 top
R13  81.03,39.62 270 top
R14  95.25,37.59 270 top
R15  93.22,100.58 90 top
R16  50.55,122.94 90 top
R17  97.28,38.61 270 top
R18  73.91,86.36 270 top
R19  36.32,73.15 270 top
R20  29.21,70.1 270 top
R21  39.37,93.47 90 top
R22  78.99,88.39 270 top
R23  56.64,52.83 90 top
R24  20.07,74.17 90 top
R26  68.83,56.9 90 top
R27  42.42,82.3 270 top
R28  97.28,84.33 270 top
R29  68.83,69.09 270 top
R30  23.11,71.12 90 top
R31  25.15,48.77 90 top
R32  50.55,70.1 270 top
R33  70.87,59.94 270 top
R34  22.1,50.8 90 top
R35  99.31,82.3 270 top
R36  72.9,69.09 270 top
R37  54.61,54.86 90 top
R38  27.18,73.15 270 top
R39  21.08,88.39 90 top
R40  39.37,70.1 270 top
R42  102.36,120.9 90 top
R43  82.04,86.36 270 top
R44  87.12,89.41 270 top
R45  34.29,70.1 270 top
R46  62.74,73.15 270 top
R47  91.19,38.61 270 top
R48  94.23,87.38 90 top
R49  87.12,38.61 270 top
R50  32.26,73.15 270 top
R51  99.31,122.94 90 top
R52  72.9,38.61 270 top
R53  69.85,38.61 270 top
R54  89.15,120.9 270 top
R55  55.63,40.64 270 top
R56  23.11,113.79 90 top
R57  57.66,38.61 270 top
R58  47.5,36.58 270 top
R59  49.53,39.62 270 top
R60  31.24,40.64 270 top
R61  33.27,37.59 270 top
R62  25.15,35.56 270 top
R63  27.18,38.61 270 top
R64  18.03,27.43 270 top
R65  22.1,37.59 270 top
R66  50.55,57.91 90 top
R67  89.15,45.72 90 top
R68  81.03,53.85 270 top
U$1  125.73,132.08 180 top
U$2  -0.25,0 0 top
U$3  125.73,132.08 180 top

### Tracks (layer width: path | path; a pad name or v marks a point on that pad's centre or on a via)
+10V  (via drill 0.81)
  Top 0.813: v23.11,102.62 25.15,102.62 32.26,109.73 v32.26,121.92 | v70.87,61.98 69.85,62.99 69.85,66.04 70.87,67.06 70.87,75.18 72.39,79.25 72.39,83.31 80.52,102.87 80.52,125.22 v81.03,125.98
  Bottom 0.813: U$1.AA2 117.6,128.02 R51.2 98.3,128.02 83.06,128.02 v81.03,125.98 77.98,128.02 R9.2 R16.2 48.51,128.02 v32.26,121.92 | 70.87,64.01 R29.2 | 70.87,64.01 R36.2 | R29.2 R46.2 | v70.87,61.98 70.87,64.01 | R39.2 21.08,99.57 v23.11,102.62 30.23,99.57 34.29,99.57 35.31,100.58 37.34,100.58 R21.2 | R29.2 R26.2 | 70.87,64.01 R33.1
-0.7V  (via drill 0.81)
  Top 0.813: v12.95,102.62 v18.03,102.62 | v12.95,54.86 17.02,54.86 20.07,51.82 22.1,51.82 25.15,56.9 33.27,56.9 39.37,62.99 v42.42,62.99
  Bottom 0.813: D103.C 20.07,109.73 D102.A v18.03,102.62 | v12.95,102.62 9.91,98.55 9.14,93.73 9.14,61.98 D10.C v12.95,54.86 7.87,49.78 7.87,27.43 11.94,23.37 11.94,20.32 D4.C 9.91,15.24 10.92,14.22 12.95,14.22 D3.C D121.C D115.C D117.C D110.C D112.C D9.C 45.47,20.32 D15.C D14.C D107.C 56.64,21.34 59.69,21.34 D99.C D22.C D21.C 73.91,23.37 D95.C D94.C D29.C 87.12,24.38 89.15,24.38 D87.C D36.C D86.C | D37.C v42.42,62.99 D61.C
-3V  (via drill 0.81)
  Top 0.813: v40.39,106.68 v40.39,127 42.42,127 52.58,122.94 54.61,122.94 68.83,130.05 86.11,130.05 87.63,128.78 87.63,122.17 89.15,120.9 89.15,117.86 90.93,116.33 90.93,110.74 v89.15,108.71 | v55.63,68.07 39.37,68.07 37.34,71.12 35.31,71.12 34.29,70.1 34.29,67.06 28.19,60.96 23.11,60.96 v18.03,56.9
  Bottom 0.813: 28.19,118.87 C17.2 | 28.19,118.87 R56.2 21.08,120.9 17.02,120.9 14.99,118.87 D100.C 12.95,111.76 12.95,105.66 14.99,102.62 14.99,97.54 11.94,93.47 11.94,62.99 14.22,60.96 | 28.19,118.87 28.19,121.92 33.27,127 v40.39,127 | v40.39,106.68 D27.A | D124.A v89.15,108.71 D73.A | D53.A D58.A 14.22,60.96 | 14.22,60.96 v18.03,56.9 D59.A D64.A | v55.63,68.07 D84.A
-15V  (via drill 0.81)
  Top 0.813: v84.07,125.98 v84.07,93.47 | v17.02,43.69 14.99,45.72 10.92,45.72 8.89,47.75 8.89,57.91 v14.99,65.02
  Bottom 0.813: R17.1 R14.1 92.2,42.67 R47.1 R49.1 85.09,44.7 R13.1 77.98,44.7 R12.1 R52.1 R53.1 R7.1 R10.1 R57.1 R55.1 | R60.1 R4.1 R3.1 R5.1 R58.1 | R60.1 R61.1 | R63.1 R60.1 | R31.1 R63.1 | R31.1 R62.1 R31.1 | R31.1 R65.1 R34.1 v20.07,44.7 v18.03,47.75 v17.02,43.69 | R31.1 R63.1 | R31.1 R63.1 | R2.1 v17.02,43.69 | R2.1 R1.1 13.97,36.58 R64.1 | R58.1 R59.1 | R58.1 R59.1 | R59.1 R6.1 R55.1 | U$1.AB2 116.59,124.97 110.49,124.97 107.44,120.9 104.39,120.9 R42.2 R54.1 v84.07,125.98 82.04,122.94 80.01,122.94 75.95,125.98 R11.1 48.51,125.98 25.15,113.79 25.15,110.74 R56.1 23.11,105.66 21.08,103.63 19.05,99.57 13.97,93.47 13.21,84.84 13.21,72.14 | R28.1 R35.1 R48.1 90.17,86.36 88.14,86.36 84.07,91.44 v84.07,93.47 | R18.1 R22.1 R43.1 v84.07,93.47 | v84.07,93.47 R44.1 R15.1 R8.1 | R24.1 R30.1 | 13.21,72.14 16,72.14 R24.1 | 13.21,72.14 13.21,67.06 v14.99,65.02 | R24.1 R38.1 R20.1 R50.1 R45.1 R19.1 R40.1 | R55.1 R23.1 R37.1 | R2.1 v17.02,43.69
A-D_CONV  (via drill 0.81)
  Top 0.406: v108.46,20.32 108.46,19.3 92.84,3.68 23.5,3.68 18.03,9.14 v16,9.14
  Bottom 0.406: U$1.BP2 117.93,19.99 117.6,20.32 v108.46,20.32 | v16,9.14 D120.A D3.A 15.62,5.71 12.32,5.71 D2.A
AC0+1
  Bottom 0.406: U$1.AT2 117.96,80.26 108.46,80.26 101.35,73.15 101.35,62.99 98.3,56.9 98.3,53.85 101.35,46.74 101.35,22.35 D39.A 99.31,18.29 97.28,16.26 D36.A
AC0+2  (via drill 0.81)
  Top 0.406: v108.46,48.77 102.36,42.42 102.36,21.34 91.19,10.16 70.87,10.16 70.36,10.92 v64.77,18.29
  Bottom 0.406: U$1.BD2 117.6,48.77 v108.46,48.77 | v64.77,18.29 D26.A D22.A
AC0-1  (via drill 0.81)
  Top 0.406: v106.43,57.91 106.43,50.8 93.22,35.56 93.22,32.51 91.19,30.48 91.19,28.45 v83.06,20.32
  Bottom 0.406: U$1.BA2 117.71,58.02 117.6,57.91 v106.43,57.91 | D29.A D31.A v83.06,20.32
AC0-2  (via drill 0.81)
  Top 0.406: v108.46,37.59 105.41,35.56 105.41,20.77 91.76,7.11 53.59,7.11 50.04,11.18 50.04,12.95 v46.48,16.26
  Bottom 0.406: U$1.BF2 117.6,41.66 116.59,42.67 108.46,42.67 106.43,41.66 106.43,39.62 v108.46,37.59 | v46.48,16.26 D17.A D15.A
AC1+1
  Bottom 0.406: U$1.AU2 117.94,77.22 106.68,77.22 102.36,72.9 102.36,61.98 99.31,56.9 99.31,53.85 102.36,46.74 102.36,20 96.58,14.22 93.22,14.22 D87.A D89.A
AC1+2  (via drill 0.81)
  Top 0.406: v60.71,18.29 67.82,9.14 91.44,9.14 103.38,21.08 103.38,41.66 v108.46,45.72
  Bottom 0.406: U$1.BE2 117.93,45.39 117.6,45.72 v108.46,45.72 | D99.A D105.A v60.71,18.29
AC1-1  (via drill 0.81)
  Top 0.406: v104.39,56.9 104.39,51.82 102.36,49.78 99.31,49.78 91.19,40.64 91.19,37.59 90.17,36.58 87.12,36.58 84.07,32.51 82.04,32.51 81.03,31.5 81.03,28.45 v72.9,18.29
  Bottom 0.406: v72.9,18.29 D97.A D95.A | U$1.BB2 117.64,54.9 117.6,54.86 109.47,54.86 v104.39,56.9
AC1-2  (via drill 0.81)
  Top 0.406: v108.46,40.64 104.39,36.58 104.39,20.95 91.57,8.13 61.72,8.13 55.63,14.22 55.63,16.26 v57.66,18.29
  Bottom 0.406: U$1.BH2 117.66,38.61 109.47,38.61 v108.46,40.64 | v57.66,18.29 D109.A D107.A
ADD_ENABLE
  Bottom 0.406: U$1.AL2 117.6,99.57 107.44,99.57 D43.A
CARRY_IN  (via drill 0.81)
  Top 0.406: v50.55,90.42 v50.55,96.52
  Bottom 0.406: U$1.AH2 117.6,108.71 110.49,108.71 91.19,101.6 84.07,101.6 70.87,98.55 v50.55,96.52 | v50.55,90.42 50.55,82.3 52.58,77.22 52.58,74.17 50.55,69.09 R32.2 | R32.2 C11.2 D61.A | R32.2 R66.2
CARRY_OUT
  Bottom 0.406: U$1.AJ2 117.6,105.66 110.49,105.66 96.27,101.6 92.2,100.58 62.74,96.52 49.53,93.47 Q4.3 45.47,86.36 40.64,81.79 Q5.3 26.16,81.28 R24.2 D53.C
CARRY_PULSE  (via drill 0.81)
  Top 0.406: v100.33,120.9 95.25,115.82 95.25,108.71 98.3,106.68 98.3,102.62 82.04,88.39 77.98,76.2 74.93,73.15 74.93,61.47 68.83,54.86 63.75,54.86 59.69,50.8 57.66,50.8 50.55,54.86 48.51,54.86 v44.45,49.78
  Bottom 0.406: U$1.AD2 117.6,118.87 110.49,118.87 109.47,117.86 102.36,117.86 v100.33,120.9 | D40.A v44.45,49.78 | v44.45,49.78 D37.A | v44.45,49.78 D76.A
CLEAR
  Bottom 0.406: U$1.AR2 117.6,86.36 109.47,86.36 102.36,82.3 D55.A
COMP
  Bottom 0.406: U$1.AM2 117.6,96.52 107.44,96.52 D32.A
COMPARITOR
  Bottom 0.406: U$1.BV2 117.92,4.06 105.79,4.06 105.41,3.68 12.32,3.68 9.91,6.1 D4.A 7.87,10.16 7.87,20.32 D7.A
GND  (via drill 0.81)
  Top 0.813: v94.23,52.83 v102.36,52.83 | v75.95,120.9 75.95,100.58 68.83,93.47 68.83,80.26 v66.8,78.23 | v32.26,105.66 v23.11,97.54 v12.95,97.54 | v45.47,101.6 v45.47,96.52 47.5,94.49 v47.5,85.34
  Bottom 0.813: U$1.BC2 117.68,51.74 117.6,51.82 103.38,51.82 v102.36,52.83 | v94.23,52.83 Q8.1 | U$1.AC2 117.6,121.92 110.49,121.92 108.46,119.63 103.38,119.63 101.35,123.95 94.23,123.95 | 94.23,123.95 Q12.1 | 94.23,123.95 86.11,123.95 83.06,120.9 v75.95,120.9 70.87,123.95 48.51,123.95 C17.1 | C17.1 D103.A | v94.23,52.83 Q7.1 | D51.A Q11.1 | v66.8,78.23 D51.A | D51.A D82.A 75.95,76.2 76.96,76.2 78.99,74.17 80.01,72.14 86.11,68.07 90.17,68.07 94.23,62.99 v94.23,52.83 | Q1.1 58.67,103.63 58.67,101.6 56.64,99.57 54.61,99.57 Q2.1 v45.47,101.6 v32.26,105.66 28.19,112.78 C17.1 | v12.95,97.54 10.41,93.47 10.67,62.99 10.67,62.23 14.99,58.17 14.99,52.83 C21.2 | v23.11,97.54 Q10.1 | v45.47,96.52 Q4.1 | v47.5,85.34 Q6.1
HALF_ADD
  Bottom 0.406: U$1.AN2 116.59,93.47 110.49,93.47 101.35,96.52 D18.A
INPUT_MIXER
  Bottom 0.406: U$1.AE2 117.6,115.82 D74.A | R42.1 D74.A | R42.1 D74.A | R42.1 99.31,115.82 94.74,120.65 92.96,120.65 D73.C
MB1  (via drill 0.81)
  Top 0.406: v40.39,17.27 31.24,27.43 31.24,29.46 29.21,31.5 29.21,34.54 23.62,39.62 23.62,49.78 | 23.62,49.78 v14.99,49.78 | 23.62,49.78 26.16,49.78 31.24,54.86 33.27,54.86 36.32,57.91 40.39,57.91 41.4,59.94 45.47,59.94 47.5,61.98 48.51,61.98 49.53,60.96 51.56,60.96 v53.59,62.99
  Bottom 0.406: D1.A 13.97,10.16 17.02,13.21 30.23,13.21 34.29,17.27 v40.39,17.27 D12.A | U$1.AK2 117.6,102.62 104.39,102.62 D42.A D19.A 91.19,99.57 62.74,95.5 53.59,92.46 51.56,86.36 51.56,82.3 53.59,77.22 v53.59,62.99 | v14.99,49.78 D10.A
MB1-1
  Bottom 0.406: U$1.BU2 107.59,7.26 105.03,4.7 20.45,4.7 D121.A D123.A
MB_2_AC
  Bottom 0.406: U$1.BR2 110.06,16.84 101.35,8.13 48.51,8.13 D8.A | D8.A D9.A D8.A
N$1  (via drill 0.81)
  Top 0.406: v87.12,90.42 92.96,83.82 92.96,75.18 88.65,71.12 88.65,62.99 85.6,60.96 85.6,58.17 78.99,48.77 v78.99,42.42
  Bottom 0.406: 63.75,42.42 51.31,42.42 48.51,39.62 46.48,39.62 44.45,42.67 D16.C 39.37,42.67 D11.C 34.29,40.64 28.19,40.64 26.16,38.61 v18.03,37.59 D6.C | 63.75,42.42 v78.99,42.42 83.06,42.42 | D38.C 99.31,43.69 97.28,40.64 92.2,40.64 90.42,42.42 89.15,42.42 | 83.06,42.42 89.15,42.42 | 83.06,42.42 D30.C | 63.75,42.42 D25.C | 89.15,42.42 R67.1 | v87.12,90.42 D50.C
N$2  (via drill 0.81)
  Top 0.406: v55.63,90.42 v55.63,102.62
  Bottom 0.406: R11.2 Q1.3 51.31,106.43 | v55.63,102.62 51.31,106.43 | 51.31,106.43 48.51,108.71 Q2.3 D27.C | v55.63,90.42 53.59,87.38 53.59,81.28 55.63,74.17 59.69,69.09 61.72,69.09 66.8,76.2 73.91,76.2 74.93,75.18 74.93,72.14 D44.A D78.A
N$3
  Bottom 0.406: D7.C R2.2 D5.C D6.A C1.2
N$4
  Bottom 0.406: R1.2 13.97,23.37 D5.A 13.97,18.54 | 13.97,18.54 D1.C D2.C | 13.97,18.54 C1.1
N$5
  Bottom 0.406: D18.C D19.C R8.2 93.22,103.63 71.88,104.65 69.85,106.68 69.85,113.79 68.83,115.82 D23.C
N$6
  Bottom 0.406: R3.2 C2.1 39.37,29.46 D8.C
N$7
  Bottom 0.406: R4.2 D11.A 37.34,28.45 C2.2 D12.C
N$8  (via drill 0.81)
  Top 0.406: v36.32,54.86 32.26,50.8 32.26,47.75 40.39,38.61 49.53,38.61 53.34,42.42 58.42,42.42 61.72,46.74 67.82,46.74 70.87,48.77 70.87,52.83 81.03,62.99 86.11,62.99 v87.12,64.01
  Bottom 0.406: D45.A Q8.3 | D45.A v87.12,64.01 D60.A | D45.A C10.2 | v36.32,54.86 D41.A D90.A D63.A R31.2 25.15,56.9 D59.C
N$9
  Bottom 0.406: D65.A D72.A 97.28,52.83 Q7.3 89.15,46.74 C13.2 82.04,50.8 80.01,50.8 76.96,47.75 63.75,47.75 59.69,50.8 57.66,50.8 50.55,54.86 43.43,54.86 D77.A 35.31,49.78 D79.A D49.A 26.16,49.78 22.1,53.85 R34.2 D64.C
N$10
  Bottom 0.406: D55.C R28.2 D60.C D56.C
N$11
  Bottom 0.406: D57.C D56.A
N$12
  Bottom 0.406: R5.2 44.45,34.54 C3.1 44.45,31.5 D13.C
N$13
  Bottom 0.406: D101.A D102.C
N$14
  Bottom 0.406: D17.C C3.2 D16.A 43.18,33.27 43.18,35.56 44.45,37.59 R6.2
N$15
  Bottom 0.406: R29.1 D57.A 77.98,61.98 77.98,59.94 75.95,57.91 Q3.1 81.03,53.85 C10.1 R67.2 Q7.2
N$16
  Bottom 0.406: D100.A D101.C
N$17
  Bottom 0.406: D66.A D67.C
N$18
  Bottom 0.406: D20.C C4.1 R7.2
N$19
  Bottom 0.406: D26.C D25.A R10.2 C4.2
N$20
  Bottom 0.406: D69.A Q8.2 92.2,56.9 C13.1 R68.1 | R68.1 78.99,64.01 72.9,72.14 R36.1 | Q9.1 R68.1
N$21
  Bottom 0.406: D68.A D69.C
N$22
  Bottom 0.406: R12.2 C5.1 D28.C
N$23
  Bottom 0.406: C5.2 R13.2 D30.A D31.C
N$24  (via drill 0.81)
  Top 0.406: v106.43,122.94 108.46,120.9 108.46,90.42 v106.43,88.39
  Bottom 0.406: D71.C v106.43,88.39 99.31,80.26 R35.2 D65.C D68.C | v106.43,122.94 D74.C
N$25  (via drill 0.81)
  Top 0.406: v70.87,45.72 72.9,45.72 74.93,43.69 74.93,42.67 76.96,40.64 76.96,38.61 77.98,37.59 82.04,37.59 v83.06,38.61 87.12,38.61 87.12,40.64 84.07,43.69 84.07,48.77 101.35,70.1 101.35,77.22 v93.22,87.38
  Bottom 0.406: D88.C v83.06,38.61 81.03,40.64 D96.C 65.79,40.64 64.77,39.62 62.74,39.62 61.72,40.64 D108.C 51.56,40.64 49.53,38.61 39.37,38.61 D113.C D118.C D122.C v20.07,34.54 | D104.C 63.75,45.72 v70.87,45.72 76.96,45.72 R68.2 | v93.22,87.38 D83.C
N$26
  Bottom 0.406: D35.C C6.1 R14.2
N$27
  Bottom 0.406: R17.2 C6.2 | R17.2 D38.A | R17.2 D39.C
N$28
  Bottom 0.406: Q9.2 C12.1 D70.C 57.66,66.04 R37.2 D62.C
N$29
  Bottom 0.406: D72.C 93.22,74.17 91.19,74.17 90.17,73.15 88.14,73.15 D78.C R43.2 C14.1
N$30
  Bottom 0.406: D45.C 81.03,73.15 D44.C C7.1 R18.2
N$31
  Bottom 0.406: D51.C 72.9,86.36 C7.2 R22.2 83.06,83.31 85.09,82.3 D50.A
N$32
  Bottom 0.406: D83.A 91.19,82.3 89.15,84.33 R44.2 C14.2 73.91,88.39 D82.C
N$33
  Bottom 0.406: D85.C C15.1 R47.2
N$34
  Bottom 0.406: C15.2 R49.2 D88.A D89.C
N$35
  Bottom 0.406: R52.2 C16.1 D93.C
N$36
  Bottom 0.406: D97.C D96.A R53.2 C16.2
N$37
  Bottom 0.406: D98.C 59.44,23.88 59.44,28.19 C18.1 55.63,32.51 R55.2
N$38
  Bottom 0.406: D104.A C18.2 R57.2 61.72,30.48 61.72,27.43 D105.C
N$39
  Bottom 0.406: D24.A Q1.2 58.17,113.28 R9.1
N$40
  Bottom 0.406: D23.A D24.C
N$41
  Bottom 0.406: R58.2 C19.1 D106.C
N$42
  Bottom 0.406: D109.C D108.A C19.2 R59.2
N$44
  Bottom 0.406: D33.A D34.C
N$45
  Bottom 0.406: R60.2 29.21,33.53 29.21,31.5 31.24,29.46 C20.1 D111.C
N$46
  Bottom 0.406: C20.2 R61.2 D113.A D114.C
N$47
  Bottom 0.406: C12.2 D70.A 52.58,56.9 48.51,56.9 D76.C 43.43,59.94 D77.C R40.2
N$48
  Bottom 0.406: D32.C 102.36,108.71 99.31,111.76 97.28,111.76 R15.2 72.9,105.66 71.88,106.68 71.88,112.78 D33.C
N$49
  Bottom 0.406: D116.C C22.1 26.16,21.34 26.16,25.4 23.11,27.43 23.11,29.46 R62.2
N$50
  Bottom 0.406: D119.C 28.19,28.45 | 28.19,28.45 28.19,31.5 R63.2 | 28.19,28.45 25.65,28.45 C22.2 | 28.19,28.45 D118.A
N$51
  Bottom 0.406: D34.A 65.79,109.73 63.75,115.82 59.69,119.89 53.59,119.89 R16.1 50.55,109.22 Q2.2
N$52
  Bottom 0.406: Q4.2 R21.1 D47.A
N$53
  Bottom 0.406: C23.1 D120.C R64.2
N$54
  Bottom 0.406: 20.07,26.42 C23.2 | D123.C 20.07,26.42 | 20.07,26.42 D122.A | 20.07,26.42 R65.2
N$55
  Bottom 0.406: D46.A D47.C
N$56  (via drill 0.81)
  Top 0.406: v73.91,101.6 v73.91,108.71 | v32.26,102.62 29.21,99.57 29.21,78.23 27.18,75.18 27.18,73.15 v29.21,71.12
  Bottom 0.406: v73.91,101.6 57.66,98.55 53.59,98.55 51.56,99.57 43.43,99.57 36.32,102.62 D46.C v32.26,102.62 | D43.C D42.C 100.33,112.78 88.14,112.78 85.09,110.74 85.09,108.71 83.06,106.68 75.95,106.68 v73.91,108.71 | D49.C R20.2 v29.21,71.12
N$57
  Bottom 0.406: Q5.2 C9.1 R27.1
N$58
  Bottom 0.406: Q6.3 R27.2 C9.2 37.34,80.26 26.16,80.26 R30.2 D58.C
N$59
  Bottom 0.406: Q5.1 30.23,86.36 Q10.3
N$60
  Bottom 0.406: Q6.2 48.51,80.26 50.55,78.23 R32.1 C11.1
N$61
  Bottom 0.406: D62.A R66.1 D54.A
N$62
  Bottom 0.406: Q10.2 R39.1 D67.A
N$63  (via drill 0.81)
  Top 0.406: v16,90.42 25.15,82.3 25.15,73.15 v27.18,71.12
  Bottom 0.406: v16,90.42 D66.C | v27.18,71.12 R38.2 D63.C
N$64
  Bottom 0.406: Q11.2 61.72,84.33 62.74,83.31 R46.1 D81.A
N$65
  Bottom 0.406: C8.1 64.52,49.02 59.69,52.83 D48.A 52.58,55.88 44.45,55.88 D40.C 38.35,57.91 36.32,59.94 D41.C R19.2
N$66
  Bottom 0.406: D80.A D81.C
N$67  (via drill 0.81)
  Top 0.406: v40.39,70.1 50.55,70.1 53.59,75.18 53.59,83.31 v55.63,85.34
  Bottom 0.406: D79.C R45.2 34.29,68.07 36.32,70.1 v40.39,70.1 | v55.63,85.34 D80.C
N$68
  Bottom 0.406: R51.1 95.25,121.92 Q12.2 91.19,121.92 86.11,121.92 84.07,119.89 D92.A
N$69  (via drill 0.81)
  Top 0.406: v36.32,111.76 37.85,109.73 37.85,82.3 32.26,76.2 v32.26,71.12
  Bottom 0.406: D91.C 74.93,118.87 69.85,121.92 50.55,121.92 42.42,118.87 v36.32,111.76 | D90.C R50.2 v32.26,71.12
N$70
  Bottom 0.406: D91.A D92.C
N$71
  Bottom 0.406: Q3.2 68.83,53.85 C8.2 60.71,57.91 R23.2 | R23.2 D48.C | R23.2 51.56,57.91 D54.C
N$73
  Bottom 0.406: Q3.3 72.9,49.78 R26.1
N$74
  Bottom 0.406: R33.2 Q9.3
ONE
  Bottom 0.406: U$1.AP2 110.49,89.41 106.43,92.46 98.3,92.46 | 98.3,92.46 R48.2 | 98.3,92.46 98.3,96.52 97.28,97.54 90.17,97.54 88.14,96.52 78.99,96.52 72.9,94.49 62.74,94.49 59.69,92.46 59.69,88.39 | 59.69,88.39 59.69,84.33 D84.C | 59.69,88.39 Q11.3
RAL  (via drill 0.81)
  Top 0.406: v107.44,66.04 107.44,59.94 108.46,58.93 108.46,56.9 107.44,55.88 107.44,49.78 101.35,43.18 101.35,24.38 97.28,20.32 v89.15,20.32
  Bottom 0.406: U$1.AV2 117.95,74.17 105.41,74.17 104.39,73.15 104.39,69.09 v107.44,66.04 | D86.A D35.A D85.A v89.15,20.32
RAR
  Bottom 0.406: U$1.BJ2 117.73,35.56 108.46,35.56 103.38,30.48 103.38,16.7 99.82,13.21 84.07,13.21 D94.A D28.A D93.A
RTL
  Bottom 0.406: U$1.BK2 117.86,32.51 108.46,32.51 104.39,28.45 104.39,15.24 100.33,11.18 72.39,11.18 D21.A | D21.A 68.83,11.18 61.72,11.18 D98.A | D21.A D20.A
RTR
  Bottom 0.406: U$1.BL2 117.96,29.46 108.46,29.46 105.41,26.42 105.41,14.22 100.33,9.14 54.61,9.14 D14.A | D14.A D13.A | D14.A D106.A
SET
  Bottom 0.406: U$1.AS2 117.6,83.31 110.49,83.31 D71.A
SR  (via drill 0.81)
  Top 0.406: v38.35,9.14 36.83,7.62 27.69,7.62 22.1,13.21 22.1,19.3 20.07,21.34 20.07,23.37 18.03,25.4 18.03,29.46 16,31.5 16,34.54 13.97,36.58 13.97,38.61 v10.92,40.64
  Bottom 0.406: U$1.BS2 109.93,13.66 103.38,7.11 40.39,7.11 v38.35,9.14 | v38.35,9.14 D112.A | v38.35,9.14 D114.A | v10.92,40.64 C21.1
SR_2_AC  (via drill 0.81)
  Top 0.406: v108.46,24.38 106.43,22.67 106.43,20.32 92.14,6.03 48.64,6.03 42.42,12.19 40.39,12.19 38.35,14.22 v34.29,14.22
  Bottom 0.406: U$1.BN2 109.65,23.19 v108.46,24.38 | v34.29,14.22 D111.A D110.A
TTI
  Bottom 0.406: U$1.BT2 108.79,10.49 104.39,6.1 D117.A D119.A
TTI_2_AC  (via drill 0.81)
  Top 0.406: v108.46,22.35 107.38,21.59 107.38,19.56 92.14,4.7 25.53,4.7 v24.13,6.1
  Bottom 0.406: U$1.BM2 117.68,26.34 117.6,26.42 107.44,26.42 106.43,25.4 106.43,24.38 v108.46,22.35 | v24.13,6.1 D115.A v24.13,6.1 | v24.13,6.1 D116.A
ZERO
  Bottom 0.406: U$1.AF2 117.6,111.76 110.49,111.76 108.46,113.79 99.31,113.79 Q12.3 R54.2 D124.C

### Text on the board
Bottom: PDP8 ACCUMULATOR R210I | 8-66
200bmp: C:/Users/Vince/Documents/websvn/trunk/Eagle/projects/DEC/Rxxx/R210/P1040594b.bmp